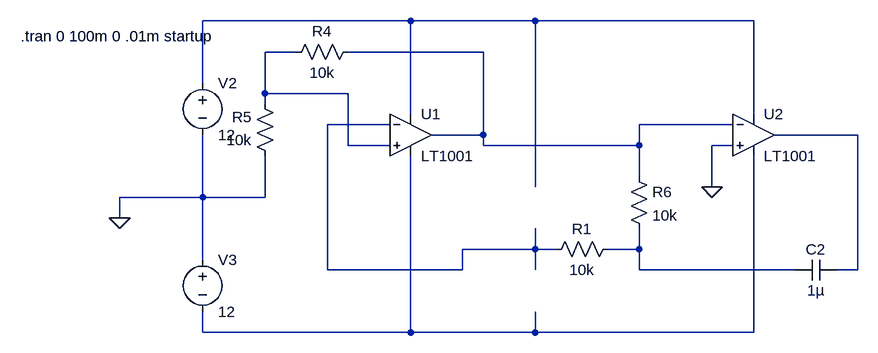
[diagram p0: schematic osc_rc.asc]
osc_rc.asc, the LTspice schematic file:
Version 4
SHEET 1 880 680
WIRE 112 -304 -208 -304
WIRE 304 -304 112 -304
WIRE 640 -304 304 -304
WIRE -64 -256 -112 -256
WIRE 224 -256 16 -256
WIRE -208 -208 -208 -304
WIRE -112 -192 -112 -256
WIRE 16 -192 -112 -192
WIRE -112 -176 -112 -192
WIRE 112 -160 112 -304
WIRE 640 -160 640 -304
WIRE 80 -144 -16 -144
WIRE 608 -144 464 -144
WIRE 224 -128 224 -256
WIRE 224 -128 144 -128
WIRE 800 -128 672 -128
WIRE 16 -112 16 -192
WIRE 80 -112 16 -112
WIRE 224 -112 224 -128
WIRE 464 -112 464 -144
WIRE 464 -112 224 -112
WIRE 608 -112 576 -112
WIRE 464 -64 464 -112
WIRE 304 -48 304 -304
WIRE 576 -48 576 -112
WIRE -208 -32 -208 -128
WIRE -208 -32 -336 -32
WIRE -112 -32 -112 -96
WIRE -112 -32 -208 -32
WIRE -336 0 -336 -32
WIRE 304 48 304 16
WIRE 304 48 192 48
WIRE 336 48 304 48
WIRE 464 48 464 16
WIRE 464 48 416 48
WIRE -208 64 -208 -32
WIRE -16 80 -16 -144
WIRE 192 80 192 48
WIRE 192 80 -16 80
WIRE 304 80 304 48
WIRE 464 80 464 48
WIRE 704 80 464 80
WIRE 800 80 800 -128
WIRE 800 80 768 80
WIRE -208 176 -208 144
WIRE 112 176 112 -96
WIRE 112 176 -208 176
WIRE 304 176 304 144
WIRE 304 176 112 176
WIRE 640 176 640 -96
WIRE 640 176 304 176
FLAG -336 0 0
FLAG 576 -48 0
SYMBOL voltage -208 -224 R0
WINDOW 123 0 0 Left 2
WINDOW 39 0 0 Left 2
SYMATTR InstName V2
SYMATTR Value 12
SYMBOL voltage -208 48 R0
WINDOW 123 0 0 Left 2
WINDOW 39 0 0 Left 2
SYMATTR InstName V3
SYMATTR Value 12
SYMBOL res 32 -272 R90
WINDOW 0 0 56 VBottom 2
WINDOW 3 32 56 VTop 2
SYMATTR InstName R4
SYMATTR Value 10k
SYMBOL res -96 -80 R180
WINDOW 0 36 76 Left 2
WINDOW 3 36 40 Left 2
SYMATTR InstName R5
SYMATTR Value 10k
SYMBOL cap 768 64 R90
WINDOW 0 0 32 VBottom 2
WINDOW 3 32 32 VTop 2
SYMATTR InstName C2
SYMATTR Value 1µ
SYMBOL res 448 -80 R0
SYMATTR InstName R6
SYMATTR Value 10k
SYMBOL res 432 32 R90
WINDOW 0 0 56 VBottom 2
WINDOW 3 32 56 VTop 2
SYMATTR InstName R1
SYMATTR Value 10k
SYMBOL Opamps\\LT1001 112 -192 R0
SYMATTR InstName U1
SYMBOL Opamps\\LT1001 640 -192 R0
SYMATTR InstName U2
TEXT -488 -280 Left 2 !.tran 0 100m 0 .01m startup

The netlist it stands for:
* osc_rc.asc
V2 N001 0 12
V3 0 N007 12
R4 N003 N002 10k
R5 0 N002 10k
C2 N005 N006 1µ
R6 N003 N006 10k
R1 N006 N004 10k
XU1 N002 N004 N001 N007 N003 LT1001  ; pins In+ In- V+ V- OUT
XU2 0 N003 N001 N007 N005 LT1001  ; pins In+ In- V+ V- OUT
.tran 0 100m 0 .01m startup
.lib LTC.lib
.backanno
.end